# Altium schematic sheet top.SchDoc
size A4; SheetNumber: 1; SheetTotal: 4
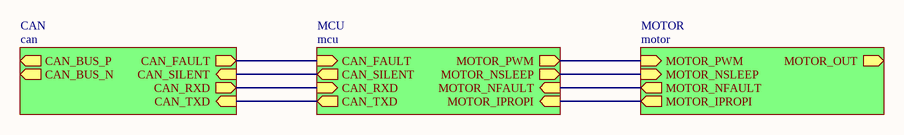
[diagram p0: top.SchDoc]

## Sub-sheets
CAN = can: CAN_TXD (in), CAN_RXD (out), CAN_FAULT (out), CAN_SILENT (in), CAN_BUS_P (out), CAN_BUS_N (out)
MCU = mcu: CAN_TXD (out), CAN_SILENT (out), CAN_RXD (in), CAN_FAULT (in), MOTOR_PWM (out), MOTOR_NSLEEP (out), MOTOR_NFAULT (in), MOTOR_IPROPI (in)
MOTOR = motor: MOTOR_OUT (out), MOTOR_PWM (in), MOTOR_NSLEEP (in), MOTOR_NFAULT (out), MOTOR_IPROPI (out)

## Nets
(unnamed): sheet MCU/CAN_TXD, sheet CAN/CAN_TXD
(unnamed): sheet MCU/CAN_SILENT, sheet CAN/CAN_SILENT
(unnamed): sheet MCU/CAN_RXD, sheet CAN/CAN_RXD
(unnamed): sheet MCU/CAN_FAULT, sheet CAN/CAN_FAULT
(unnamed): sheet MCU/MOTOR_PWM, sheet MOTOR/MOTOR_PWM
(unnamed): sheet MCU/MOTOR_NSLEEP, sheet MOTOR/MOTOR_NSLEEP
(unnamed): sheet MCU/MOTOR_NFAULT, sheet MOTOR/MOTOR_NFAULT
(unnamed): sheet MCU/MOTOR_IPROPI, sheet MOTOR/MOTOR_IPROPI